# Altium schematic sheet MISC.schdoc: TEBF0808 - MISC
size A4; DocumentNumber: TEBF0808; Revision: 04; SheetNumber: 8; SheetTotal: 36; Date: 2016-09-29; CompanyName: Trenz Electronic GmbH; Organization: Trenz Electronic GmbH
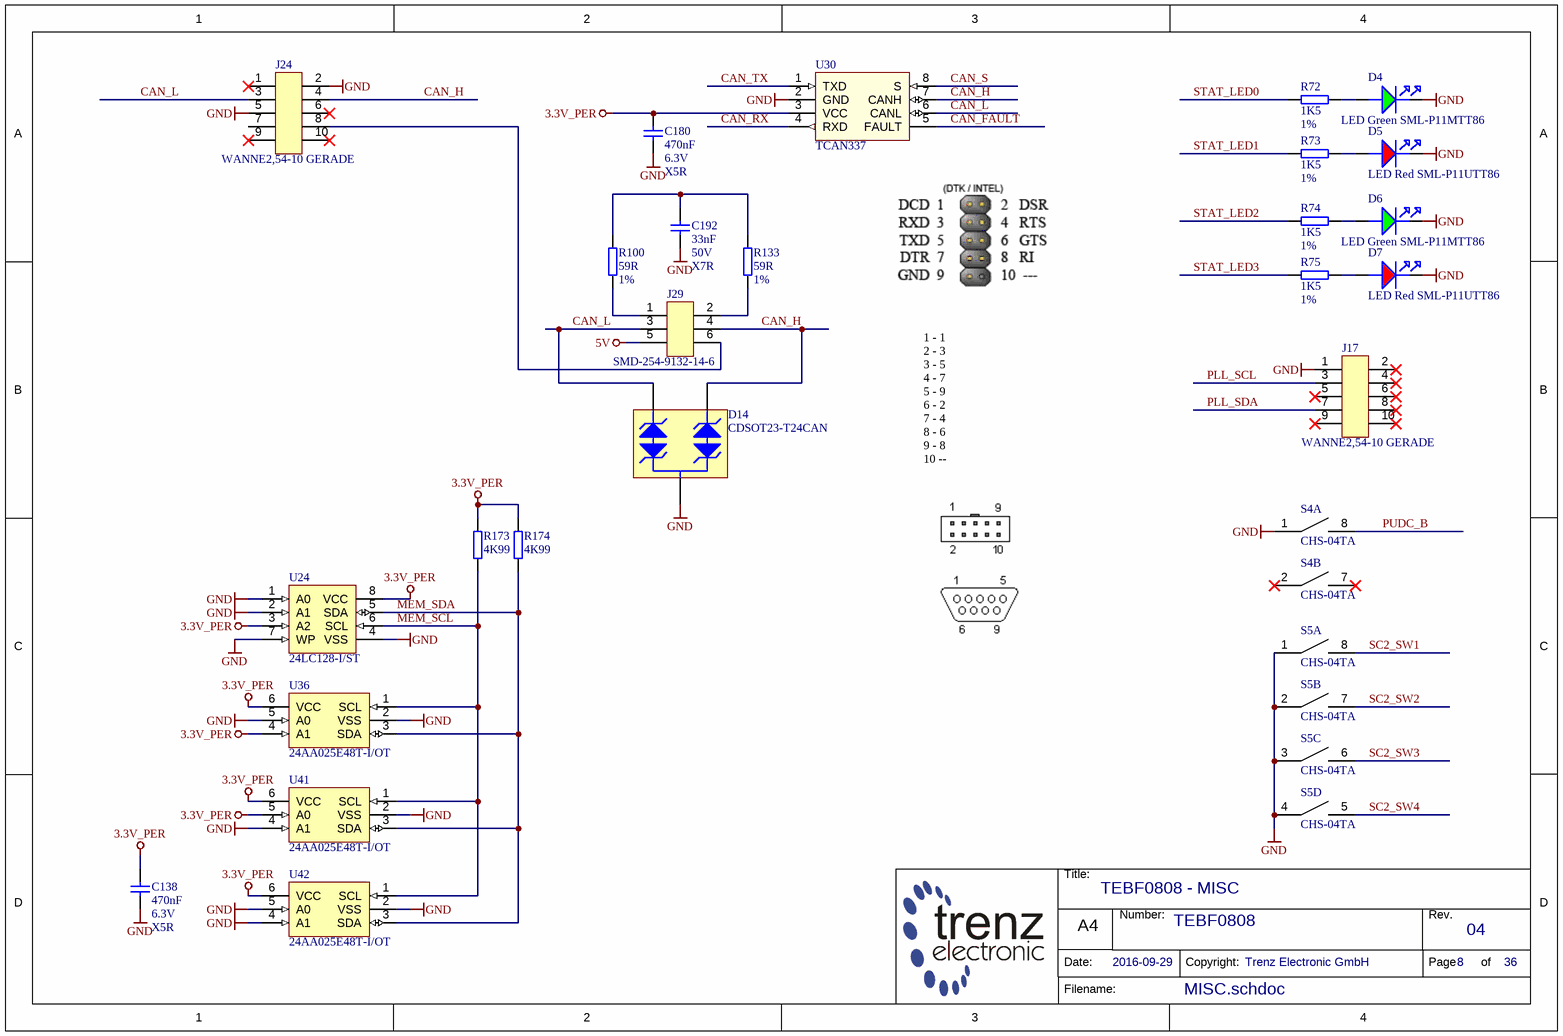
[diagram p0: MISC.schdoc]

## Parts
C138  470nF  Voltage: 6.3V  Technology: X5R  [CAPC1005X55N]
C180  470nF  Voltage: 6.3V  Technology: X5R  [CAPC1005X55N]
C192  33nF  Voltage: 50V  Technology: X7R  [CAPC1608X90N]
D4  LED Green SML-P11MTT86  [LEDC1006X25N_GREEN]
D5  LED Red SML-P11UTT86  [LEDC1006X25N_RED]
D6  LED Green SML-P11MTT86  [LEDC1006X25N_GREEN]
D7  LED Red SML-P11UTT86  [LEDC1006X25N_RED]
D14  CDSOT23-T24CAN  [SOT95P237X112-3N]
J17  WANNE2,54-10 GERADE  [WANNE2,54-10 GERADE]
J24  WANNE2,54-10 GERADE  [WANNE2,54-10 GERADE]
J29  SMD-254-9132-14-6  [SMD-254-9132-14-6]
R72  1K5  Tolerance: 1%  [RESC1005X40N]
R73  1K5  Tolerance: 1%  [RESC1005X40N]
R74  1K5  Tolerance: 1%  [RESC1005X40N]
R75  1K5  Tolerance: 1%  [RESC1005X40N]
R100  59R  Tolerance: 1%  [RESC6332X80N]
R133  59R  Tolerance: 1%  [RESC6332X80N]
R173  4K99  [RESC1005X40N]
R174  4K99  [RESC1005X40N]
S4  CHS-04TA  [CHS-04TA]  (parts A,B of 4)
S5  CHS-04TA  [CHS-04TA]  (parts A,B,C,D of 4)
U24  24LC128-I/ST  [SOP65P640X120-8N-MC]
U30  TCAN337  [SOIC127P600X175-8N]
U36  24AA025E48T-I/OT  [SOT95P280X145-6N]
U41  24AA025E48T-I/OT  [SOT95P280X145-6N]
U42  24AA025E48T-I/OT  [SOT95P280X145-6N]

## Nets
3.3V_PER: C138.1 C180.2 R173.1 R174.1 U24.3(A2) U24.8(VCC) U30.3(VCC) U36.4(A1) U36.6(VCC) U41.5(A0) U41.6(VCC) U42.6(VCC)
5V: J29.5
GND: C138.2 C180.1 C192.1 D4.K D5.K D6.K D7.K D14.3(GND) J17.1 J24.2 J24.5 S4.1 S5.1 S5.2 S5.3 S5.4 U24.1(A0) U24.2(A1) U24.4(VSS) U24.7(WP) U30.2(GND) U36.2(VSS) U36.5(A0) U41.2(VSS) U41.4(A1) U42.2(VSS) U42.4(A1) U42.5(A0)
CAN_FAULT: U30.5(FAULT)
CAN_H: D14.1(IO1) J24.4 J29.4 U30.7(CANH)
CAN_L: D14.2(IO2) J24.3 J29.3 U30.6(CANL)
CAN_RX: U30.4(RXD)
CAN_S: U30.8(S)
CAN_TX: U30.1(TXD)
MEM_SCL: R173.2 U24.6(SCL) U36.1(SCL) U41.1(SCL) U42.1(SCL)
MEM_SDA: R174.2 U24.5(SDA) U36.3(SDA) U41.3(SDA) U42.3(SDA)
PLL_SCL: J17.3
PLL_SDA: J17.7
PUDC_B: S4.8
SC2_SW1: S5.8
SC2_SW2: S5.7
SC2_SW3: S5.6
SC2_SW4: S5.5
STAT_LED0: R72.1
STAT_LED1: R73.1
STAT_LED2: R74.1
STAT_LED3: R75.1
NetC192_2: C192.2 R100.1 R133.1
NetD4_A: D4.A R72.2
NetD5_A: D5.A R73.2
NetD6_A: D6.A R74.2
NetD7_A: D7.A R75.2
NetJ24_8: J24.8 J29.6
NetJ29_1: J29.1 R100.2
NetJ29_2: J29.2 R133.2

Not connected (* = marked no-connect by the designer): J17 2* 4* 5* 6* 8* 9* 10*; J24 1* 6* 7 9* 10*; S4 2* 7*

## Notes on the sheet
- 1 - 1
  2 - 3
  3 - 5
  4 - 7
  5 - 9
  6 - 2
  7 - 4
  8 - 6
  9 - 8
  10 --
- Title:
- Number:
- Rev.
- Date:
- A4
- Copyright:
- Page
- of
- Filename:

## Library data of the parts
C138 C180 = 23659: KON 470nF 6,3V X5R SMD; AN: 23659; Mixed: SMT; Value: 470n; Preferred: Yes; Case: 1005 (0402)
C192 = 23923: KON 33nF 50V X7R SMD 10%; AN: 23923; Value: 33n; Mixed: SMT; Preferred: Yes; Case: 1608 (0603); Tolerance: 10%
D4 D6 = 24211: LED Grün SML-P11MTT86 SMD; AN: 24211; Mixed: SMT; Preferred: Yes; Case: 1005 (0402); HelpURL: B:\AD\adlib\datasheet\SML-P1; H-ART: SML-P11MTT86
D5 D7 = 24212: LED Rot SML-P11UTT86 SMD; AN: 24212; Mixed: SMT; Preferred: Yes; Case: 1005 (0402); HelpURL: B:\AD\adlib\datasheet\SML-P1; H-ART: SML-P11UTT86
D14 = 27400: AN: 27400; Mixed: SMT; Case: SOT23-3; HelpURL: b:\AD\adlib\datasheet\CDSOT23-T24CAN; H-ART: CDSOT23-T24CAN
J17 J24 = 20125: Stiftleiste Wanne 10polig; AN: 20125; Mixed: THT; Trenz-Stock: Yes; HelpURL: B:\AD\adlib\datasheet\137
J29 = 22742: Stiftleiste gerade 2-reihig, 6pol. SMD; AN: 22742; Mixed: SMT; Trenz-Stock: Yes; H-ART: 9132-14-06-00-0-00; HelpURL: B:\AD\adlib\datasheet\9532_9132
R72-R75 = 22602: WID SMD 1K5 1% 0,063W; AN: 22602; Mixed: SMT; Value: 1.5K; Preferred: Yes; Case: 1005 (0402); Technology: TK100
R100 R133 = 27515: WID SMD 59R 2W 1%; AN: 27515; Mixed: SMT; Value: 59; Case: 6332 (2512); Technology: TK100, 2W
R173 R174 = 22754: WID SMD 4K99 1% 0,063W; AN: 22754; Value: 4.99K; Mixed: SMT; Preferred: Yes; Case: 1005 (0402); Tolerance: 1%; Technology: TK100
S4 S5 = 23417: DIP Schalter 4 fach 1,27mm SMD; AN: 23417; Mixed: SMT; Trenz-Stock: Yes; HelpURL: B:\AD\adlib\datasheet\CHS; Preferred: Yes; H-ART: CHS-04TA
U24 = 22933: AN: 22933; Mixed: SMT; Trenz-Stock: Yes; Case: TSSOP8; HelpURL: B:\AD\adlib\datasheet\24LC128; Preferred: Yes; H-ART: 24LC128-I/ST
U30 = 27518: TCAN337GDR  CAN Transceivers; AN: 27518; Mixed: SMT; Case: SO8; HelpURL: b:\AD\adlib\datasheet\TCAN33x\; H-ART: TCAN337GDR
U36 U41 U42 = 26249: AN: 26249; Mixed: SMT; Case: SOT23-6; HelpURL: B:\AD\adlib\datasheet\24AA02xExx; H-ART: 24AA025E48T-I/OT